# Altium schematic sheet fram.SchDoc
size A3; DocumentNumber: 33; SheetNumber: 33; SheetTotal: 45; SheetDescription: Ferroelectric Random Access Memory (FRAM)
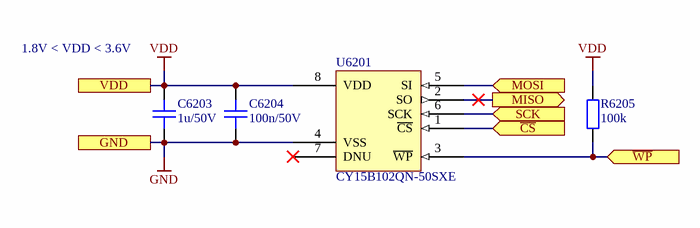
[diagram p0: fram.SchDoc]

## Parts
C6203  1u/50V  [CAPC1608X08N]
C6204  100n/50V  [CAPC1005X06N]
R6205  100k  [RESC1005X04N]
U6201  CY15B102QN-50SXE  [CY15B102QN-50SXE]

## Ports
GND, MISO (out), MOSI (in), SCK (in), VDD, ~{CS} (in), ~{WP} (in)

## Nets
GND: C6203.1 C6204.1 U6201.4(VSS) ; port GND
VDD: C6203.2 C6204.2 R6205.2 U6201.8(VDD) ; port VDD
~{CS}: U6201.1(~{CS}) ; port ~{CS}
~{WP}: R6205.1 U6201.3(~{WP}) ; port ~{WP}
MISO: U6201.2(SO) ; port MISO
MOSI: U6201.5(SI) ; port MOSI
SCK: U6201.6(SCK) ; port SCK

Not connected (* = marked no-connect by the designer): U6201 7(DNU)*

## Notes on the sheet
- (near C6203) 1.8V < VDD < 3.6V
- Fraunhofer IISB
- Schottkystr. 10
- developed by:
- 91058 Erlangen
- Germany
- Author
- Project
- License
- Description
- File
- Version
- Release Date
- Sheet
- foxbms.org <https://foxbms.org>
- www.iisb.fraunhofer.de <https://www.iisb.fraunhofer.de/>
- foxBMS Team
- /

## Library data of the parts
C6203 = gen_C_ceramic_1u_50V_X7R_0603: MLCC; Capacitance: 1u; Rated Voltage: 50V; Dielectric: X7R; Case EIA: 0603; Case Metric: 1608; Automotive Qualified: False; Tolerance: ± 10%; PnP Package: 0603C; Part Number: gen_C_ceramic_1u_50V_X7R_0603; Operating Temperature: -55°C - +125°C; Supplier 1: Farnell; Supplier Part Number 1: 2779055
C6204 = gen_C_ceramic_100n_50V_X7R_0402: MLCC; Capacitance: 100n; Rated Voltage: 50V; Dielectric: X7R; Case EIA: 0402; Case Metric: 1005; PnP Package: 0402C; PnP Value: 100nF/50V/X7R; PnP equipped: x; Automotive Qualified: True; AEC-Q Norm: AEC-Q200; Part Number: gen_C_ceramic_100n_50V_X7R_0402; Supplier 1: Farnell; Supplier Part Number 1: 2210822; ECCN: EAR99
R6205 = gen_R_100k_0402: SMD Resistor 100k 0402; Tolerance: 1%; Power: 0.063W; Case EIA: 0402; Case Metric: 1005; Maximum Working Voltage: 50V; PnP Package: 0402R; PnP equipped: x; Automotive Qualified: True; Part Number: gen_R_100k_0402; Operating Temperature: -55°C - +155°C; Resistance: 100k; Series: E24, E96; PnP Value: 100k; Supplier 1: Farnell; Supplier Part Number 1: 2302839
U6201 = CY15B102QN-50SXE: Excelon™-Auto 2-Mbit (256K × 8) Automotive-E Serial (SPI) F-RAM; Manufacturer: Cypress; PnP Package: SOIC-8; Automotive Qualified: True; Part Number: CY15B102QN-50SXE; Part Name: CY15B102QN-50SXE; Operating Temperature: −40°C - +125°C; ComponentLink1Description: Datasheet; ComponentLink1URL: https://www.cypress.com/file/400736/download; Supplier 1: Mouser; Supplier Part Number 1: 727-CY15B102QN-50SXE